# Altium schematic sheet Ignition Injection Breakaway.SchDoc: IGNITION INJECTION LOOM
size A3; CheckedBy: TIMOTHY WARNOCK; Author: TIMOTHY WARNOCK; CompanyName: CURTIN MOTORSPORT TEAM; DrawnBy: TIMOTHY WARNOCK; Engineer: TIMOTHY WARNOCK; Revision: 2; SheetNumber: 2; SheetTotal: 5; ProjectName: 2017 PERMANENT LOOM
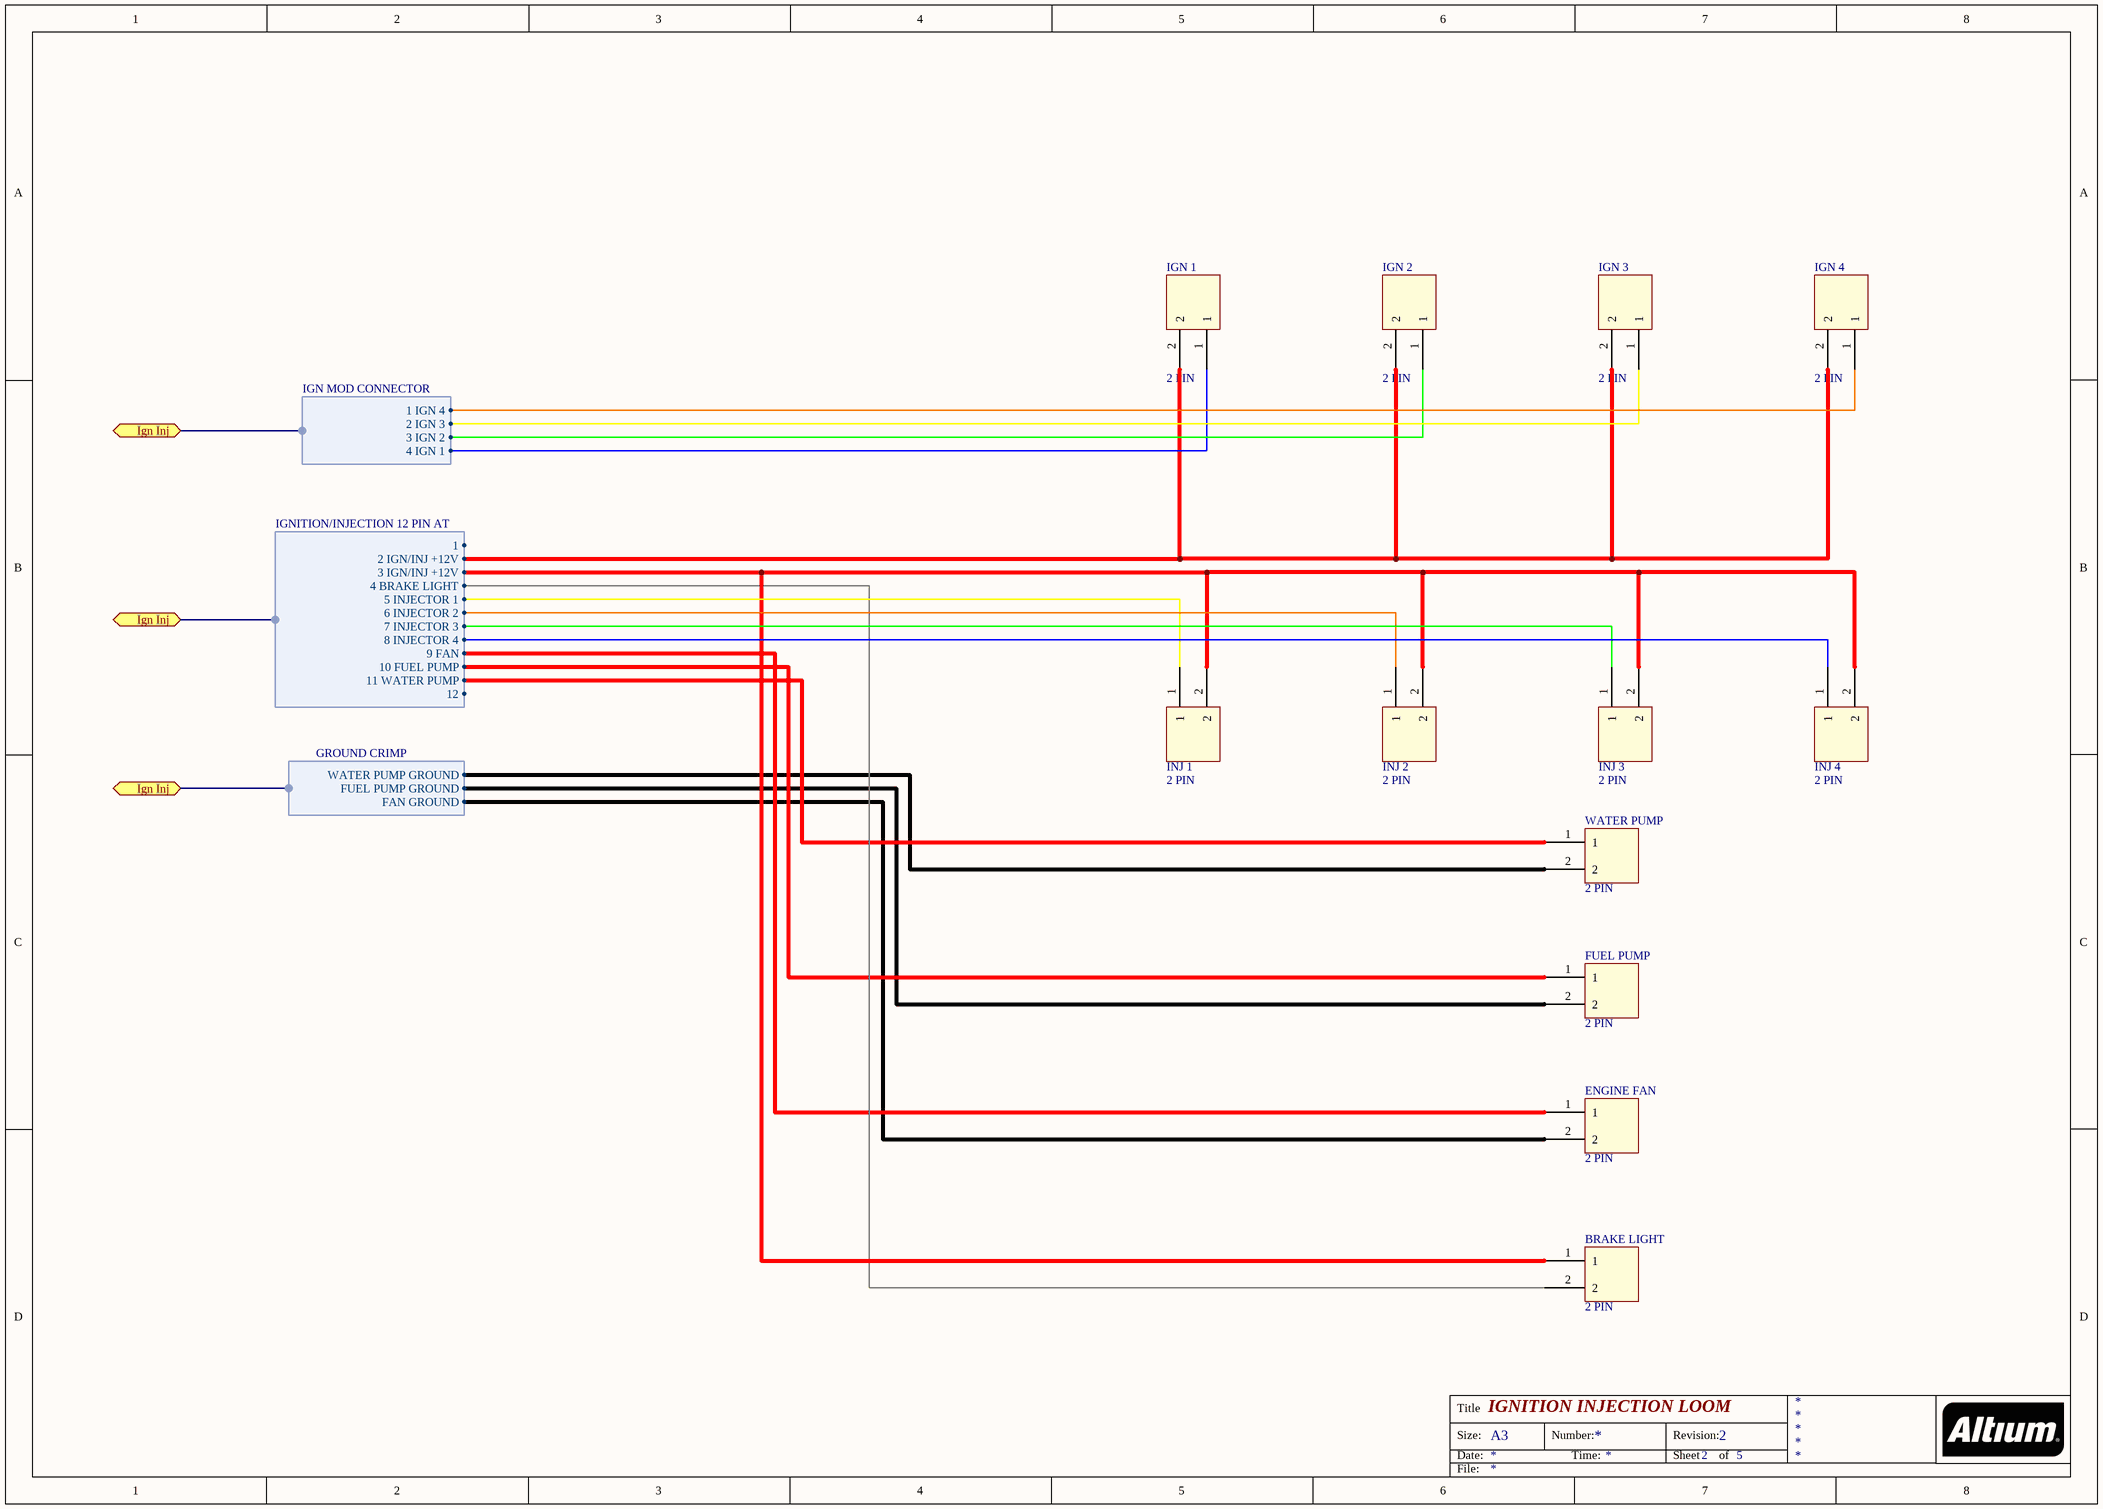
[diagram p0: Ignition Injection Breakaway.SchDoc]

## Parts
BRAKE_LIGHT  2 PIN
ENGINE_FAN  2 PIN
FUEL_PUMP  2 PIN
IGN_1  2 PIN
IGN_2  2 PIN
IGN_3  2 PIN
IGN_4  2 PIN
INJ_1  2 PIN
INJ_2  2 PIN
INJ_3  2 PIN
INJ_4  2 PIN
WATER_PUMP  2 PIN

## Ports
Ign Inj

## Harnesses
IGNITION/INJECTION 12 PIN AT: 1, 2 IGN/INJ +12V, 3 IGN/INJ +12V, 4 BRAKE LIGHT, 5 INJECTOR 1, 6 INJECTOR 2, 7 INJECTOR 3, 8 INJECTOR 4, 9 FAN, 10 FUEL PUMP, 11 WATER PUMP, 12
IGN MOD CONNECTOR: 1 IGN 4, 2 IGN 3, 3 IGN 2, 4 IGN 1
GROUND CRIMP: WATER PUMP GROUND, FUEL PUMP GROUND, FAN GROUND

## Nets
NetBRAKE_LIGHT_1: BRAKE_LIGHT.1 INJ_1.2 INJ_2.2 INJ_3.2 INJ_4.2 ; harness IGNITION/INJECTION 12 PIN AT.3 IGN/INJ +12V
NetBRAKE_LIGHT_2: BRAKE_LIGHT.2 ; harness IGNITION/INJECTION 12 PIN AT.4 BRAKE LIGHT
NetENGINE_FAN_1: ENGINE_FAN.1 ; harness IGNITION/INJECTION 12 PIN AT.9 FAN
NetENGINE_FAN_2: ENGINE_FAN.2 ; harness GROUND CRIMP.FAN GROUND
NetFUEL_PUMP_1: FUEL_PUMP.1 ; harness IGNITION/INJECTION 12 PIN AT.10 FUEL PUMP
NetFUEL_PUMP_2: FUEL_PUMP.2 ; harness GROUND CRIMP.FUEL PUMP GROUND
NetIGN_1_1: IGN_1.1 ; harness IGN MOD CONNECTOR.4 IGN 1
NetIGN_1_2: IGN_1.2 IGN_2.2 IGN_3.2 IGN_4.2 ; harness IGNITION/INJECTION 12 PIN AT.2 IGN/INJ +12V
NetIGN_2_1: IGN_2.1 ; harness IGN MOD CONNECTOR.3 IGN 2
NetIGN_3_1: IGN_3.1 ; harness IGN MOD CONNECTOR.2 IGN 3
NetIGN_4_1: IGN_4.1 ; harness IGN MOD CONNECTOR.1 IGN 4
NetINJ_1_1: INJ_1.1 ; harness IGNITION/INJECTION 12 PIN AT.5 INJECTOR 1
NetINJ_2_1: INJ_2.1 ; harness IGNITION/INJECTION 12 PIN AT.6 INJECTOR 2
NetINJ_3_1: INJ_3.1 ; harness IGNITION/INJECTION 12 PIN AT.7 INJECTOR 3
NetINJ_4_1: INJ_4.1 ; harness IGNITION/INJECTION 12 PIN AT.8 INJECTOR 4
NetWATER_PUMP_1: WATER_PUMP.1 ; harness IGNITION/INJECTION 12 PIN AT.11 WATER PUMP
NetWATER_PUMP_2: WATER_PUMP.2 ; harness GROUND CRIMP.WATER PUMP GROUND

## Notes on the sheet
- Title
- Size:
- Date:
- A3
- Number:
- Time:
- Revision:
- Sheet
- of
- File: